# Altium schematic sheet Wi-Fi.schdoc
size Tabloid
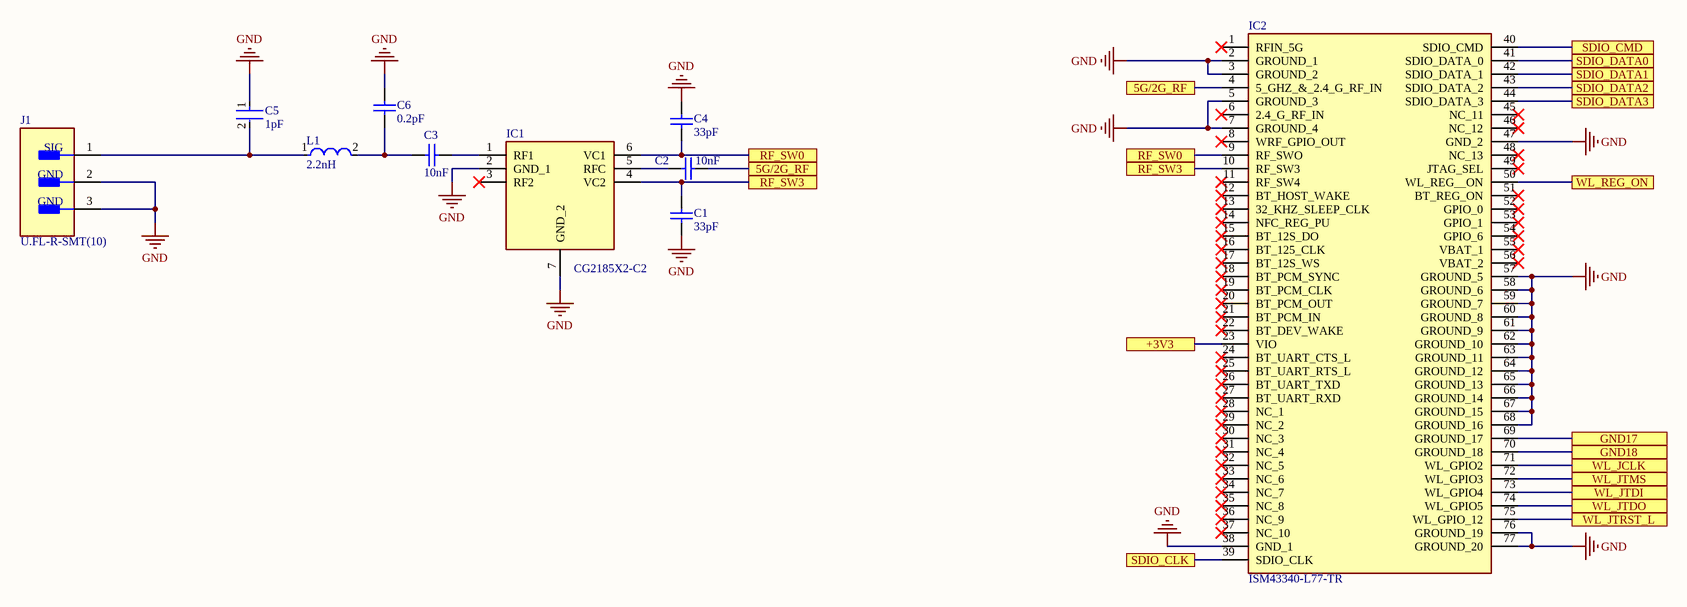
[diagram p0: Wi-Fi.schdoc]

## Parts
C1  33pF  [CAPC1005X56X25ML10T15]
C2  10nF  [CAPC1608X90X35ML10T15]
C3  10nF  [CAPC1608X90X35ML10T15]
C4  33pF  [CAPC1005X56X25ML10T15]
C5  1pF  [FP-GJM155-0_05-IPC_B]
C6  0.2pF  [CAPC1608X74X38NL10T13]
IC1  CG2185X2-C2  [SON35P100X100X37-7N]
IC2  ISM43340-L77-TR  [ISM43340L77TR]
J1  U.FL-R-SMT(10)  [FP-U_FL-R-SMT_10-MFG]
L1  2.2nH  [FP-LQW15AN_00-W0_6-0_1-MFG]

## Ports
5G/2G_RF, +3V3, GND17, GND18, RF_SW0, RF_SW3, SDIO_CLK, SDIO_CMD, SDIO_DATA0, SDIO_DATA1, SDIO_DATA2, SDIO_DATA3, WL_JCLK, WL_JTDI, WL_JTDO, WL_JTMS, WL_JTRST_L, WL_REG_ON

## Nets
GND: C1.1 C4.2 C5.1 C6.2 IC1.2(GND_1) IC1.7(GND_2) IC2.2(GROUND_1) IC2.3(GROUND_2) IC2.5(GROUND_3) IC2.7(GROUND_4) IC2.38(GND_1) IC2.47(GND_2) IC2.57(GROUND_5) IC2.58(GROUND_6) IC2.59(GROUND_7) IC2.60(GROUND_8) IC2.61(GROUND_9) IC2.62(GROUND_10) IC2.63(GROUND_11) IC2.64(GROUND_12) IC2.65(GROUND_13) IC2.66(GROUND_14) IC2.67(GROUND_15) IC2.68(GROUND_16) IC2.76(GROUND_19) IC2.77(GROUND_20) J1.2(GND) J1.3(GND)
5G/2G_RF: C2.2 IC2.4(5_GHZ_&_2.4_G_RF_IN) ; port 5G/2G_RF
+3V3: IC2.23(VIO) ; port +3V3
GND17: IC2.69(GROUND_17) ; port GND17
GND18: IC2.70(GROUND_18) ; port GND18
RF_SW0: C4.1 IC1.6(VC1) IC2.9(RF_SWO) ; port RF_SW0
RF_SW3: C1.2 IC1.4(VC2) IC2.10(RF_SW3) ; port RF_SW3
SDIO_CLK: IC2.39(SDIO_CLK) ; port SDIO_CLK
SDIO_CMD: IC2.40(SDIO_CMD) ; port SDIO_CMD
SDIO_DATA0: IC2.41(SDIO_DATA_0) ; port SDIO_DATA0
SDIO_DATA1: IC2.42(SDIO_DATA_1) ; port SDIO_DATA1
SDIO_DATA2: IC2.43(SDIO_DATA_2) ; port SDIO_DATA2
SDIO_DATA3: IC2.44(SDIO_DATA_3) ; port SDIO_DATA3
WL_JCLK: IC2.71(WL_GPIO2) ; port WL_JCLK
WL_JTDI: IC2.73(WL_GPIO4) ; port WL_JTDI
WL_JTDO: IC2.74(WL_GPIO5) ; port WL_JTDO
WL_JTMS: IC2.72(WL_GPIO3) ; port WL_JTMS
WL_JTRST_L: IC2.75(WL_GPIO_12) ; port WL_JTRST_L
WL_REG_ON: IC2.50(WL_REG__ON) ; port WL_REG_ON
NetC2_1: C2.1 IC1.5(RFC)
NetC3_1: C3.1 C6.1 L1.2
NetC3_2: C3.2 IC1.1(RF1)
NetC5_2: C5.2 J1.1(SIG) L1.1

Not connected (* = marked no-connect by the designer): IC1 3(RF2)*; IC2 1(RFIN_5G)* 6(2.4_G_RF_IN)* 8(WRF_GPIO_OUT)* 11(RF_SW4)* 12(BT_HOST_WAKE)* 13(32_KHZ_SLEEP_CLK)* 14(NFC_REG_PU)* 15(BT_12S_DO)* 16(BT_125_CLK)* 17(BT_12S_WS)* 18(BT_PCM_SYNC)* 19(BT_PCM_CLK)* 20(BT_PCM_OUT)* 21(BT_PCM_IN)* 22(BT_DEV_WAKE)* 24(BT_UART_CTS_L)* 25(BT_UART_RTS_L)* 26(BT_UART_TXD)* 27(BT_UART_RXD)* 28(NC_1)* 29(NC_2)* 30(NC_3)* 31(NC_4)* 32(NC_5)* 33(NC_6)* 34(NC_7)* 35(NC_8)* 36(NC_9)* 37(NC_10)* 45(NC_11)* 46(NC_12)* 48(NC_13)* 49(JTAG_SEL)* 51(BT_REG_ON)* 52(GPIO_0)* 53(GPIO_1)* 54(GPIO_6)* 55(VBAT_1)* 56(VBAT_2)*

## Notes on the sheet
- Title
- Size:
- Date:
- Tabloid
- Number:
- Time:
- Revision:
- Sheet
- of
- File:

## Library data of the parts
C1 C4 = CMP-2008-02637-1: Manufacturer: AVX Interconnect / Elco; Part Number: 04025A330JAT2A
C2 C3 = CMP-2100-03642-1: Chip Capacitor, 10 nF, +/- 10%, 50 V, -55 to 125 degC, 0603 (1608 Metric), RoHS, Tape and Reel; Manufacturer: Murata; Insulation Resistance: 10GR; Dielectric: X7R; Voltage Rating: 50V; Material: Ceramic; Package Quantity: 1; Lead Free: LeadFree; Case/Package: 0603; Termination: SMD/SMT; REACH SVHC: Unknown; Manufacturer URL: http://www.murata.com/; Datasheet URL: http://search.murata.co.jp/Ceramy/image/img/A01X/G101/ENG/GRM188R71H103KA01-01.pdf; Mount: SurfaceMount; Datasheet Version: 42401.0; Number of Pins: 2; Length: 1.6mm; Voltage: 50V; Depth: 0.8mm; Tolerance: 10%; Min Operating Temperature: -55degC; Voltage Rating (DC): 50V; Max Operating Temperature: 125degC; Package Description: 2-Pin Surface Mount Device, Body 1.6 x 0.8 mm; RoHSCompliant: True; Case Code (Imperial): 0603; Width: 0.031inch; Case Code (Metric): 1608; Height: 0.8mm; Package Reference: 0603; Packaging: TapeandReel; Thickness: 0.035inch; Capacitance: 10nF; Dielectric Material: Ceramic
C5 = CMP-2008-03808-2: Multi-Layer Ceramic Capacitor 1pF C0G  ±0.1pF 0402 Paper T/R; Temperature Coefficient: 30ppm/°C; Voltage Rating (DC): 50V; REACH SVHC: No SVHC; Packaging: Tape and Reel; Width: 0.02inch; Package Quantity: 10000; Min Operating Temperature: -55°C; Case Code (Imperial): 0402; Lead Pitch: 0.3mm; Capacitance: 1pF; Length: 1mm; Max Operating Temperature: 125°C; Depth: 0.5mm; Thickness: 0.022inch; Case Code (Metric): 1005; Lead Free: Lead Free; Voltage: 50V; Mount: Surface Mount; Number of Pins: 2; Termination: SMD/SMT; Radiation Hardening: No; Dielectric: C0G; Case/Package: 0402; Voltage Rating: 50V; Height: 0.5mm
C6 = CMP-2006-03941-1: Manufacturer: AVX Interconnect / Elco; Part Number: ML03V10R2BAT2A
IC1 = CG2185X2-C2: Integrated Circuit; Manufacturer_Name: CEL; Datasheet Link: https://www.mouser.com/datasheet/2/286/CG2185X2-965115.pdf; Height: 0.37mm; Manufacturer_Part_Number: CG2185X2-C2
IC2 = ISM43340-L77-TR: Integrated Circuit; Manufacturer_Name: Inventek; Datasheet Link: https://www.mouser.com/datasheet/2/908/ISM4334X_Functional_Specification-1371237.pdf; Height: 2mm; Manufacturer_Part_Number: ISM43340-L77-TR; Mouser Part Number: 347-ISM43340L77TR; Mouser Price/Stock: https://www.mouser.com/Search/Refine.aspx?Keyword=347-ISM43340L77TR
J1 = CMP-0029-00003-2: CONN U.FL RCPT STR 50 OHM SMD; Plating: Silver; Connector Type: Coaxial; Frequency: 6GHz; Impedance: 50R; Body Material: Bronze; Dielectric Material: Polymer; Contact Plating: Gold; Termination: Solder; Orientation: Vertical; Contact Material: Brass; Min Operating Temperature: -40°C; Mount: Surface Mount; Lead Free: Lead Free; Max Operating Temperature: 90°C; Radiation Hardening: No; Packaging: Tape and Reel; Body Plating: Silver; Fastening Type: Snap; Max Frequency: 6GHz; Depth: 3.1mm; Package Quantity: 1; Case/Package: SMD/SMT; Housing Color: Beige; Length: 3mm
L1 = CMP-06042-008786-1: Wire Wound RF Inductor 2.2nH ±0.2nH 1000mA 0.027Ω 0402 (1005); Q Factor: 25; Current Rating: 1A; Core Material: Air; Test Frequency: 100MHz; Shielding: Unshielded; DC Resistance (DCR): 27mR; Self Resonant Frequency: 14GHz; Min Operating Temperature: -55°C; Package Quantity: 10000; Length: 1mm; Number of Pins: 2; Radiation Hardening: No; Case Code (Metric): 1005; Termination: SMD/SMT; Inductance: 2.2nH; Mount: Surface Mount; DC Current: 1A; Military Standard: Not; Max Operating Temperature: 125°C; Max DC Current: 1A; Lead Free: Lead Free; Depth: 0.7mm; Case/Package: 0402; Packaging: Tape and Reel; Height: 0.5mm; Width: 0.5mm; REACH SVHC: No SVHC; Weight: 2.8E-05oz; Case Code (Imperial): 0402